# Altium schematic sheet Power To Board.SchDoc
size A4; SheetNumber: 6; SheetTotal: 9
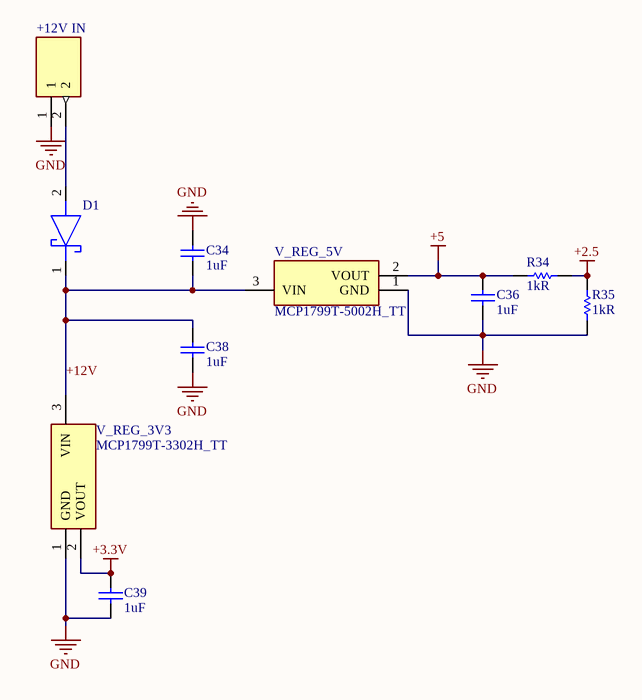
[diagram p0: Power To Board.SchDoc]

## Parts
+12V_IN  39773-0002  [397730002]  (value not drawn)
C34  1uF  [CAPC1608X90X35LL15T15]
C36  1uF  [CAPC1608X90X35LL15T15]
C38  1uF  [CAPC1608X90X35LL15T15]
C39  1uF  [CAPC1608X90X35LL15T15]
D1  NSR20F20NXT5G  [NSR20F20NXT5G]  (value not drawn)
R34  1kR  [RESC1608X55X30LL15T15]
R35  1kR  [RESC1608X55X30LL15T15]
V_REG_3V3  MCP1799T-3302H_TT  [SOT95P237X112-3N]
V_REG_5V  MCP1799T-5002H_TT  [SOT95P237X112-3N]

## Nets
+2.5: R34.1 R35.1
+3.3V: C39.2 V_REG_3V3.2(VOUT)
+5: C36.2 R34.2 V_REG_5V.2(VOUT)
GND: +12V_IN.1 C34.2 C36.1 C38.1 C39.1 R35.2 V_REG_3V3.1(GND) V_REG_5V.1(GND)
+12V: C34.1 C38.2 D1.1(K) V_REG_3V3.3(VIN) V_REG_5V.3(VIN)
Net+12V_IN_2: +12V_IN.2 D1.2(A)

## Library data of the parts
+12V_IN = 39773-0002: Connector; Manufacturer_Name: Molex; Datasheet Link: https://www.mouser.in/datasheet/2/276/2/397730002_sd-1378779.pdf; Height: 10.1mm; Manufacturer_Part_Number: 39773-0002
C34 C36 C38 C39 = CMP-2006-02298-2: Manufacturer: Kemet; Part Number: C0603C105K4RACTU
D1 = NSR20F20NXT5G: Schottky Diode; Manufacturer_Name: ON Semiconductor; Datasheet Link: https://www.onsemi.com/pdf/datasheet/nsr20f20-d.pdf; Height: 0.31mm; Manufacturer_Part_Number: NSR20F20NXT5G
R34 R35 = CMP-2000-00180-1: Part Number: ERJ-3EKF1001V; Manufacturer: Panasonic
V_REG_3V3 = MCP1799T-3302H_TT: Power Supply; Manufacturer_Name: Microchip; Manufacturer_Part_Number: MCP1799T-3302H/TT; Datasheet Link: https://ms.componentsearchengine.com/Datasheets/1/MCP1799T-3302H_TT.pdf; Height: 1.12mm
V_REG_5V = MCP1799T-5002H_TT: Integrated Circuit; Manufacturer_Name: Microchip; Manufacturer_Part_Number: MCP1799T-5002H/TT; Datasheet Link: https://www.arrow.com/en/products/mcp1799t-5002htt/microchip-technology; Height: 1.12mm